# EAGLE design draft3_4lyr_reroute (EAGLE 6.1)
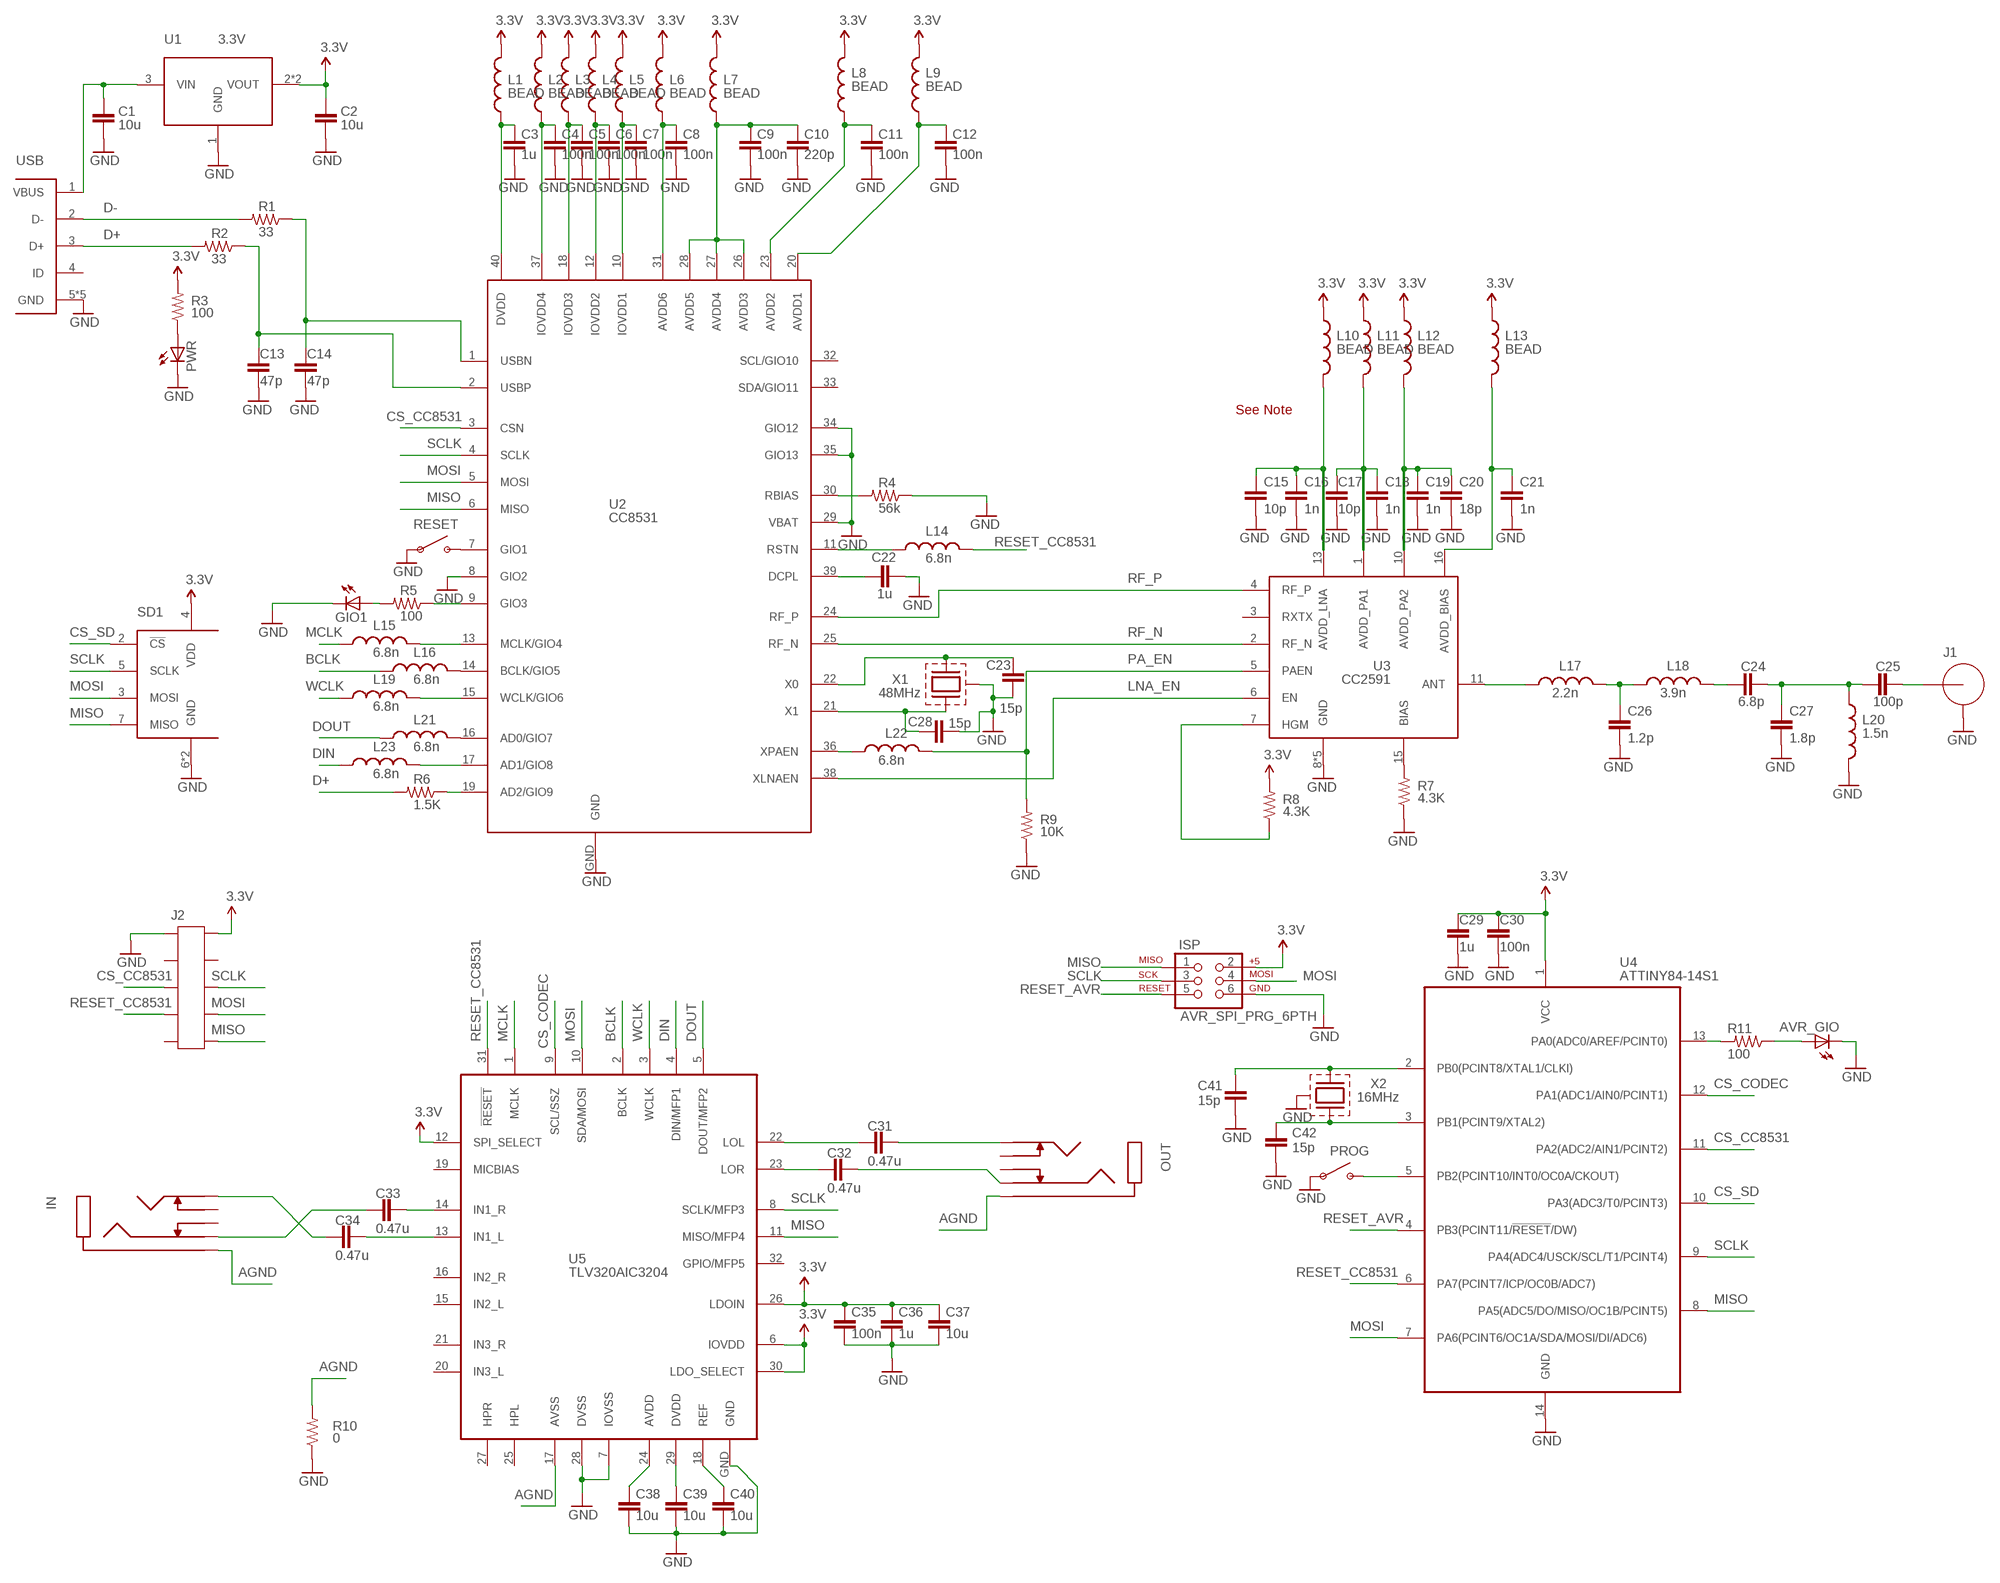
[diagram p0: schematic, sheet 1]

## Parts
AVR_GIO  LEDCHIP-LED0603  [CHIP-LED0603]
C1  10u  C-EUC0603  [C0603]
C2  10u  C-EUC0603  [C0603]
C3  1u  C-EUC0603  [C0603]
C4  100n  C-EUC0603  [C0603]
C5  100n  C-EUC0603  [C0603]
C6  100n  C-EUC0603  [C0603]
C7  100n  C-EUC0603  [C0603]
C8  100n  C-EUC0603  [C0603]
C9  100n  C-EUC0603  [C0603]
C10  220p  C-EUC0603  [C0603]
C11  100n  C-EUC0603  [C0603]
C12  100n  C-EUC0603  [C0603]
C13  47p  C-EUC0603  [C0603]
C14  47p  C-EUC0603  [C0603]
C15  10p  C-EUC0603  [C0603]
C16  1n  C-EUC0603  [C0603]
C17  10p  C-EUC0603  [C0603]
C18  1n  C-EUC0603  [C0603]
C19  1n  C-EUC0603  [C0603]
C20  18p  C-EUC0603  [C0603]
C21  1n  C-EUC0603  [C0603]
C22  1u  C-EUC0603  [C0603]
C23  15p  C-EUC0603  [C0603]
C24  6.8p  C-EUC0603  [C0603]
C25  100p  C-EUC0603  [C0603]
C26  1.2p  C-EUC0603  [C0603]
C27  1.8p  C-EUC0603  [C0603]
C28  15p  C-EUC0603  [C0603]
C29  1u  C-EUC0603  [C0603]
C30  100n  C-EUC0603  [C0603]
C31  0.47u  C-EUC0603  [C0603]
C32  0.47u  C-EUC0603  [C0603]
C33  0.47u  C-EUC0603  [C0603]
C34  0.47u  C-EUC0603  [C0603]
C35  100n  C-EUC0603  [C0603]
C36  1u  C-EUC0603  [C0603]
C37  10u  C-EUC0603  [C0603]
C38  10u  C-EUC0603  [C0603]
C39  10u  C-EUC0603  [C0603]
C40  10u  C-EUC0603  [C0603]
C41  15p  C-EUC0603  [C0603]
C42  15p  C-EUC0603  [C0603]
GIO1  LEDCHIP-LED0603  [CHIP-LED0603]
IN  PHONE_SW  [35RAPC4BV4]
ISP  AVR_SPI_PRG_6PTH  [2X3]
J1  SMA  [CONSMA003.031]
J2  HEADER-10P-SMD-MALE  [10P-0.05-HEADER]
L1  BEAD  INDUCTOR0603  [0603]
L2  BEAD  INDUCTOR0603  [0603]
L3  BEAD  INDUCTOR0603  [0603]
L4  BEAD  INDUCTOR0603  [0603]
L5  BEAD  INDUCTOR0603  [0603]
L6  BEAD  INDUCTOR0603  [0603]
L7  BEAD  INDUCTOR0603  [0603]
L8  BEAD  INDUCTOR0603  [0603]
L9  BEAD  INDUCTOR0603  [0603]
L10  BEAD  INDUCTOR0603  [0603]
L11  BEAD  INDUCTOR0603  [0603]
L12  BEAD  INDUCTOR0603  [0603]
L13  BEAD  INDUCTOR0603  [0603]
L14  6.8n  INDUCTOR0603  [0603]
L15  6.8n  INDUCTOR0603  [0603]
L16  6.8n  INDUCTOR0603  [0603]
L17  2.2n  INDUCTOR0603  [0603]
L18  3.9n  INDUCTOR0603  [0603]
L19  6.8n  INDUCTOR0603  [0603]
L20  1.5n  INDUCTOR0603  [0603]
L21  6.8n  INDUCTOR0603  [0603]
L22  6.8n  INDUCTOR0603  [0603]
L23  6.8n  INDUCTOR0603  [0603]
OUT  PHONE_SW  [35RAPC4BV4]
PROG  SPST-SMD  [TACT_SW]
PWR  LEDCHIP-LED0603  [CHIP-LED0603]
R1  33  R-US_R0603  [R0603]
R2  33  R-US_R0603  [R0603]
R3  100  R-US_R0603  [R0603]
R4  56k  R-US_R0603  [R0603]
R5  100  R-US_R0603  [R0603]
R6  1.5K  R-US_R0603  [R0603]
R7  4.3K  R-US_R0603  [R0603]
R8  4.3K  R-US_R0603  [R0603]
R9  10K  R-US_R0603  [R0603]
R10  0  R-US_R0603  [R0603]
R11  100  R-US_R0603  [R0603]
RESET  SPST-SMD  [TACT_SW]
SD1  MICROSDDM3AT  [DM3AT]
U1  3.3V  NX1117C  [SOT-223]
U2  CC8531  [S-PVQFN-N40]
U3  CC2591  [S-PVQFN-N16]
U4  ATTINY84-14S1  [SOIC14]
U5  TLV320AIC3204  [S-PVQFN-N32]
USB  USB_MICRO_AB  [USB_MICRO_AB]
X1  48MHz  XTAL-ABRACONABM3C  [ABM3C]
X2  16MHz  XTAL-ABRACONABMM  [ABMM]

## Nets
3.3V: C2.1 C29.1 C30.1 C35.1 C36.1 C37.1 ISP.2 J2.2 L1.2 L2.2 L3.2 L4.2 L5.2 L6.2 L7.2 L8.2 L9.2 L10.1 L11.1 L12.1 L13.1 R3.2 R8.2 SD1.4(VDD) U1.2(VOUT) U1.4(VOUT) U4.1(VCC) U5.6(IOVDD) U5.12(SPI_SELECT) U5.26(LDOIN) U5.30(LDO_SELECT)
AGND: IN.1(GND) OUT.1(GND) R10.2 U5.17(AVSS)
AVDD_BIAS: C21.1 L13.2 U3.16(AVDD_BIAS)
AVDD_LNA: C15.1 C16.1 L10.2 U3.13(AVDD_LNA)
AVDD_PA1: C17.1 C18.1 L11.2 U3.1(AVDD_PA1)
AVDD_PA2: C19.1 C20.1 L12.2 U3.10(AVDD_PA2)
BCLK: L16.1 U5.2(BCLK)
CS_CC8531: J2.5 U2.3(CSN) U4.11(PA2(ADC2/AIN1/PCINT2))
CS_CODEC: U4.12(PA1(ADC1/AIN0/PCINT1)) U5.9(SCL/SSZ)
CS_SD: SD1.2(!CS) U4.10(PA3(ADC3/T0/PCINT3))
D+: R2.2 R6.2 USB.3(D+)
D-: R1.2 USB.2(D-)
DIN: L23.1 U5.4(DIN/MFP1)
DOUT: L21.1 U5.5(DOUT/MFP2)
GND: AVR_GIO.C C1.2 C2.2 C3.2 C4.2 C5.2 C6.2 C7.2 C8.2 C9.2 C10.2 C11.2 C12.2 C13.2 C14.2 C15.2 C16.2 C17.2 C18.2 C19.2 C20.2 C21.2 C22.2 C23.2 C26.2 C27.2 C28.2 C29.2 C30.2 C35.2 C36.2 C37.2 C38.2 C39.2 C40.2 C41.1 C42.1 GIO1.C ISP.6 J1.GND1(GND) J1.GND2(GND) J1.GND3(GND) J1.GND4(GND) J2.1 L20.2 PROG.1 PROG.2 PWR.C R4.1 R7.1 R9.1 R10.1 RESET.1 RESET.2 SD1.6(GND) SD1.GND U1.1(GND) U2.8(GIO2) U2.29(VBAT) U2.34(GIO12) U2.35(GIO13) U2.GND U3.8(GND) U3.9(GND) U3.12(GND) U3.14(GND) U3.GND U4.14(GND) U5.7(IOVSS) U5.28(DVSS) U5.GND USB.5(GND) USB.GND1(GND) USB.GND2(GND) USB.GND3(GND) USB.GND4(GND) X1.2(CASE) X1.4(CASE) X2.2(CASE) X2.4(CASE)
IOVDD1: C14.1 R1.1 U2.1(USBN)
IOVDD2: C13.1 R2.1 U2.2(USBP)
LNA_EN: U2.38(XLNAEN) U3.6(EN)
MCLK: L15.1 U5.1(MCLK)
MISO: ISP.1 J2.10 SD1.7(MISO) U2.6(MISO) U4.8(PA5(ADC5/DO/MISO/OC1B/PCINT5)) U5.11(MISO/MFP4)
MOSI: ISP.4 J2.8 SD1.3(MOSI) U2.5(MOSI) U4.7(PA6(PCINT6/OC1A/SDA/MOSI/DI/ADC6)) U5.10(SDA/MOSI)
N$1: C28.1 U2.21(X1) X1.1
N$2: C23.1 U2.22(X0) X1.3
N$3: L14.1 U2.11(RSTN)
N$4: PROG.3 PROG.4 U4.5(PB2(PCINT10/INT0/OC0A/CKOUT))
N$5: L16.2 U2.14(BCLK/GIO5)
N$6: C1.1 U1.3(VIN) USB.1(VBUS)
N$7: R7.2 U3.15(BIAS)
N$8: R8.1 U3.7(HGM)
N$9: C25.2 J1.SIG
N$10: L21.2 U2.16(AD0/GIO7)
N$11: RESET.3 RESET.4 U2.7(GIO1)
N$12: C38.1 U5.24(AVDD)
N$13: L17.1 U3.11(ANT)
N$14: C26.1 L17.2 L18.1
N$15: C24.1 L18.2
N$16: C24.2 C25.1 C27.1 L20.1
N$17: C9.1 C10.1 L7.1 U2.26(AVDD3) U2.27(AVDD4) U2.28(AVDD5)
N$18: L22.1 U2.36(XPAEN)
N$19: R4.2 U2.30(RBIAS)
N$20: C40.1 U5.18(REF)
N$21: C22.1 U2.39(DCPL)
N$22: C11.1 L8.1 U2.23(AVDD2)
N$23: L15.2 U2.13(MCLK/GIO4)
N$24: R6.1 U2.19(AD2/GIO9)
N$25: L19.2 U2.15(WCLK/GIO6)
N$26: C12.1 L9.1 U2.20(AVDD1)
N$27: L23.2 U2.17(AD1/GIO8)
N$28: R5.1 U2.9(GIO3)
N$29: GIO1.A R5.2
N$30: C8.1 L6.1 U2.31(AVDD6)
N$31: PWR.A R3.1
N$32: C39.1 U5.29(DVDD)
N$33: C34.1 IN.2(L)
N$34: C33.2 U5.14(IN1_R)
N$35: C34.2 U5.13(IN1_L)
N$36: C33.1 IN.4(R)
N$37: C31.2 OUT.2(L)
N$38: C32.2 OUT.4(R)
N$39: C31.1 U5.22(LOL)
N$40: C32.1 U5.23(LOR)
N$41: C7.1 L5.1 U2.10(IOVDD1)
N$42: C6.1 L4.1 U2.12(IOVDD2)
N$43: C5.1 L3.1 U2.18(IOVDD3)
N$44: C4.1 L2.1 U2.37(IOVDD4)
N$45: C3.1 L1.1 U2.40(DVDD)
N$46: R11.2 U4.13(PA0(ADC0/AREF/PCINT0))
N$47: AVR_GIO.A R11.1
N$48: C41.2 U4.2(PB0(PCINT8/XTAL1/CLKI)) X2.1
N$49: C42.2 U4.3(PB1(PCINT9/XTAL2)) X2.3
PA_EN: L22.2 R9.2 U3.5(PAEN)
RESET_AVR: ISP.5 U4.4(PB3(PCINT11/!RESET!/DW))
RESET_CC8531: J2.7 L14.2 U4.6(PA7(PCINT7/ICP/OC0B/ADC7)) U5.31(!RESET)
RF_N: U2.25(RF_N) U3.2(RF_N)
RF_P: U2.24(RF_P) U3.4(RF_P)
SCLK: ISP.3 J2.6 SD1.5(SCLK) U2.4(SCLK) U4.9(PA4(ADC4/USCK/SCL/T1/PCINT4)) U5.8(SCLK/MFP3)
WCLK: L19.1 U5.3(WCLK)
Unconnected: IN.3(R_SW) IN.5(L_SW) J2.3 J2.4 J2.9 OUT.3(R_SW) OUT.5(L_SW) U2.32(SCL/GIO10) U2.33(SDA/GIO11) U3.3(RXTX) U5.15(IN2_L) U5.16(IN2_R) U5.19(MICBIAS) U5.20(IN3_L) U5.21(IN3_R) U5.25(HPL) U5.27(HPR) U5.32(GPIO/MFP5) USB.4(ID)

## Notes on the sheet
- See Note

## Library data of the parts
AVR_GIO GIO1 PWR = led:LED: LED OSRAM: - CHIPLED LG R971, LG N971, LY N971, LG Q971, LY Q971, LO R971, LY R971 LH N974, LH R974 LS Q976, LO Q976, LY Q976 LO Q996 - Hyper CHIPLED LW Q18S LB Q993, LB Q99A, LB R99A - SideLED LS A670, LO A670, LY A670, LG A670, LP A670 LB A673, LV A673, LT A673, LW A673 LH A674 LY A675 LS A676, LA A676, LO A676, LY A676, LW A676 LS A679, LY A679, LG A679 - Hyper Micro SIDELED® LS Y876, LA Y876, LO Y876, LY Y876 LT Y87S - SmartLED LW L88C, LW L88S LB L89C, LB L89S, LG L890 LS L89K, LO L89K, LY L89K LS L896, LA L896, LO L896, LY L896 - TOPLED LS T670, LO T670, LY T670, LG T670, LP T670 LSG T670, LSP T670, LSY T670, LOP T670, LYG T670 LG T671, LOG T671, LSG T671 LB T673, LV T673, LT T673, LW T673 LH T674 LS T676, LA T676, LO T676, LY T676, LB T676, LH T676, LSB T676, LW T676 LB T67C, LV T67C, LT T67C, LS T67K, LO T67K, LY T67K, LW E67C LS E67B, LA E67B, LO E67B, LY E67B, LB E67C, LV E67C, LT E67C LW T67C LS T679, LY T679, LG T679 LS T770, LO T770, LY T770, LG T770, LP T770 LB T773, LV T773, LT T773, LW T773 LH T774 LS E675, LA E675, LY E675, LS T675 LS T776, LA T776, LO T776, LY T776, LB T776 LHGB T686 LT T68C, LB T68C - Hyper Mini TOPLED® LB M676 - Mini TOPLED Santana® LG M470 LS M47K, LO M47K, LY M47K Source: http://www.osram.convergy.de LUXEON: - LUMILED® LXK2-PW12-R00, LXK2-PW12-S00, LXK2-PW14-U00, LXK2-PW14-V00 LXK2-PM12-R00, LXK2-PM12-S00, LXK2-PM14-U00 LXK2-PE12-Q00, LXK2-PE12-R00, LXK2-PE12-S00, LXK2-PE14-T00, LXK2-PE14-U00 LXK2-PB12-K00, LXK2-PB12-L00, LXK2-PB12-M00, LXK2-PB14-N00, LXK2-PB14-P00, LXK2-PB14-Q00 LXK2-PR12-L00, LXK2-PR12-M00, LXK2-PR14-Q00, LXK2-PR14-R00 LXK2-PD12-Q00, LXK2-PD12-R00, LXK2-PD12-S00 LXK2-PH12-R00, LXK2-PH12-S00 LXK2-PL12-P00, LXK2-PL12-Q00, LXK2-PL12-R00 Source: www.luxeon.com KINGBRIGHT: KA-3528ASYC Source: www.kingbright.com
C1-C42 = rcl:C-EU: CAPACITOR, European symbol
IN OUT = 00-EvaLibrary:PHONE_SW
ISP = SparkFun-Connectors:AVR_SPI_PRG_6: AVR ISP 6 Pin This is the reduced ISP connector for AVR programming. Common on Arduino. This footprint will take up less PCB space and can be used with a 10-pin to 6-pin adapter such as SKU: BOB-08508
J1 = 00-EvaLibrary:SMA
J2 = 00-EvaLibrary:HEADER-10P
L1-L23 = SparkFun:INDUCTOR: Inductors Basic Inductor/Choke - 0603 and 1206. Footprints are not proven and vary greatly between part numbers.
PROG RESET = 00-EvaLibrary:SPST
R1-R11 = rcl:R-US_: RESISTOR, American symbol
SD1 = 00-EvaLibrary:MICROSD
U1 = 00-EvaLibrary:NX1117C
U2 = 00-EvaLibrary:CC8531
U3 = 00-EvaLibrary:CC2591
U4 = 00-EvaLibrary:ATTINY84
U5 = 00-EvaLibrary:TLV320AIC3204
USB = 00-EvaLibrary:USB_MICRO_AB
X1 X2 = 00-EvaLibrary:XTAL-ABRACON

## Board
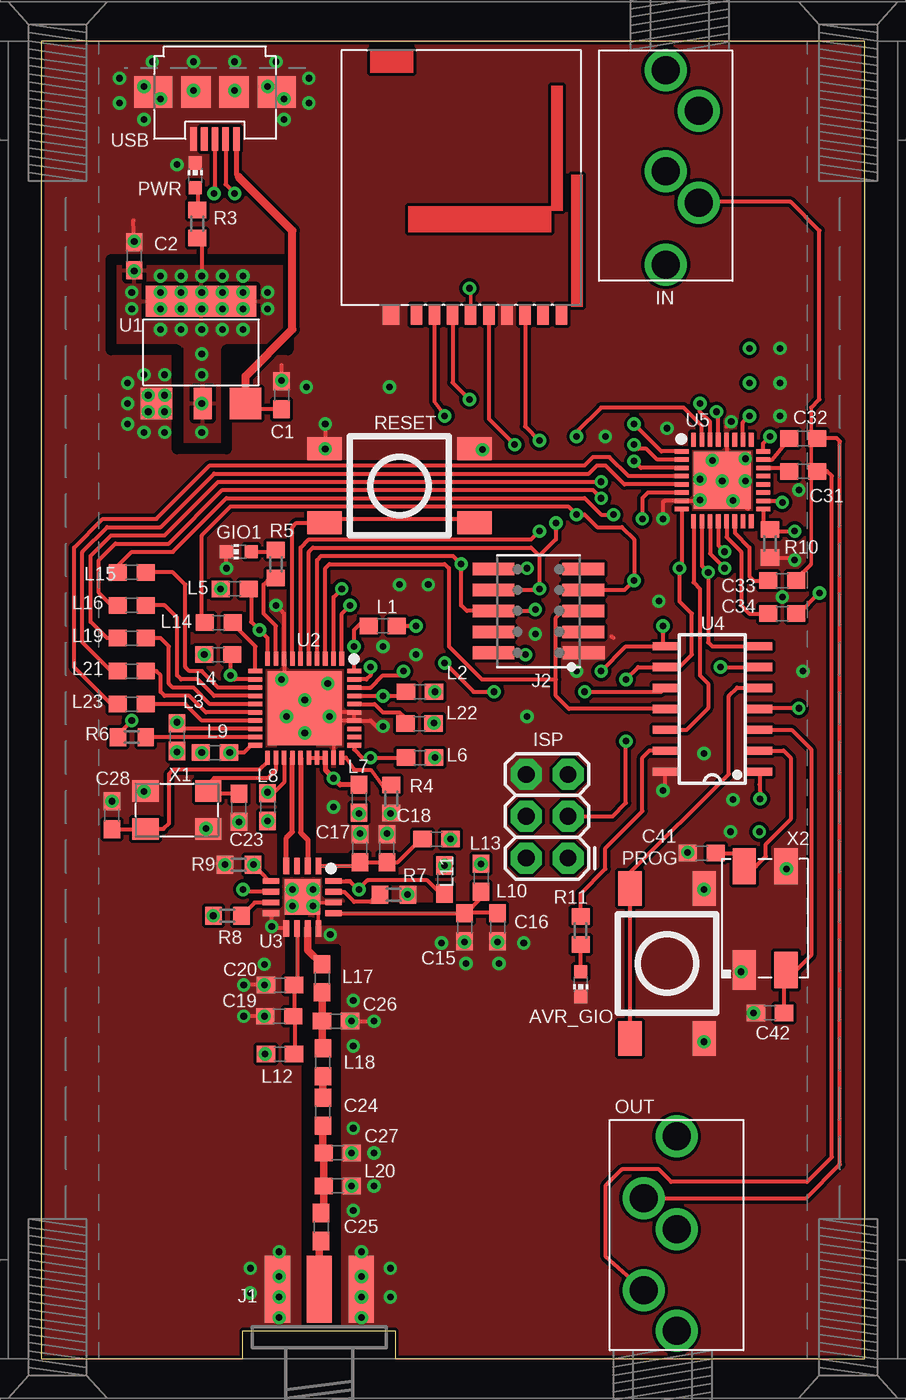
[diagram p1: board, top side]
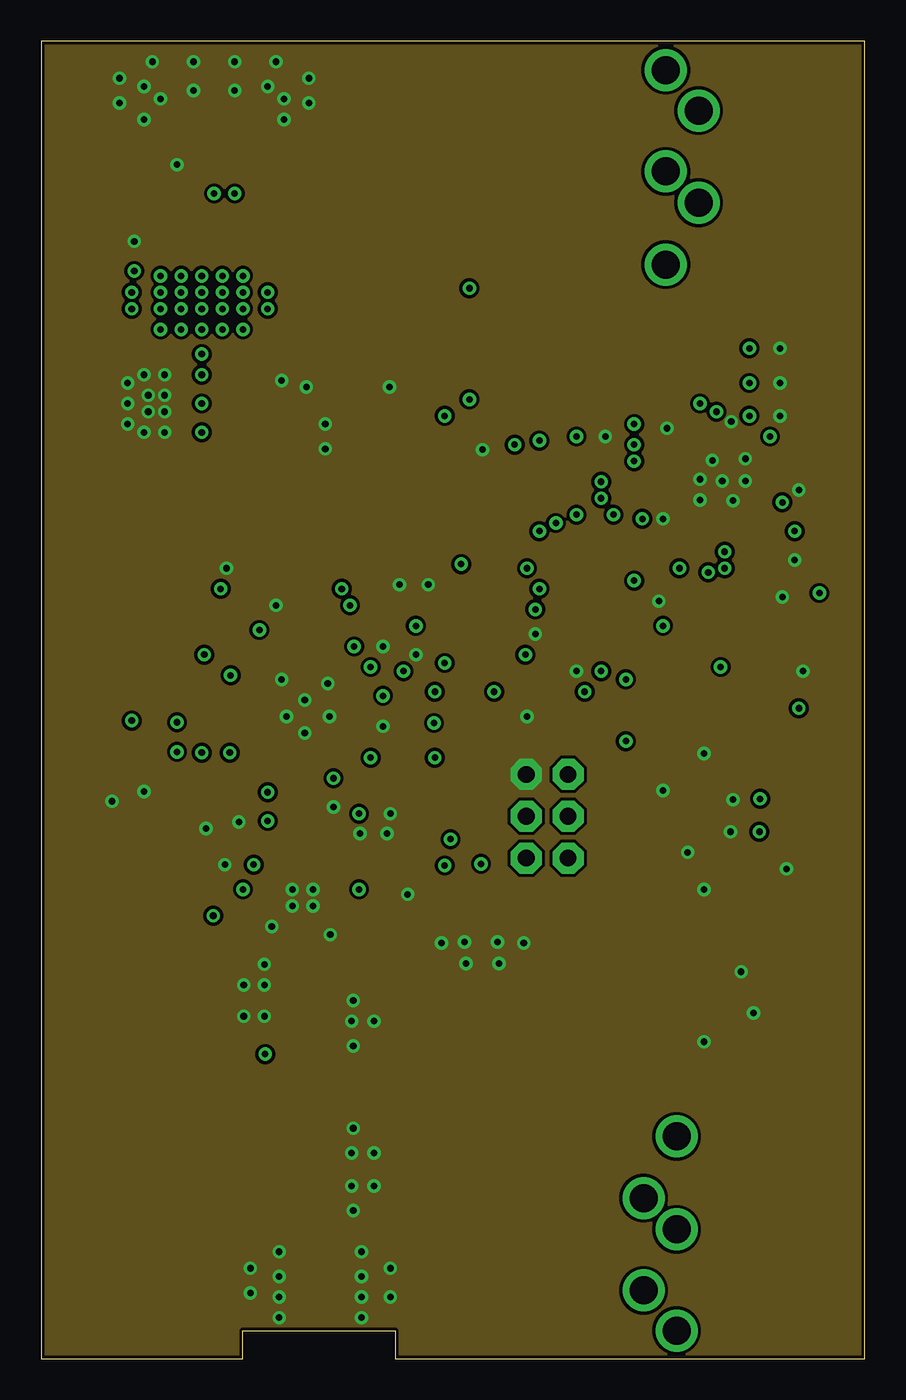
[diagram p2: board, inner layer Route2]
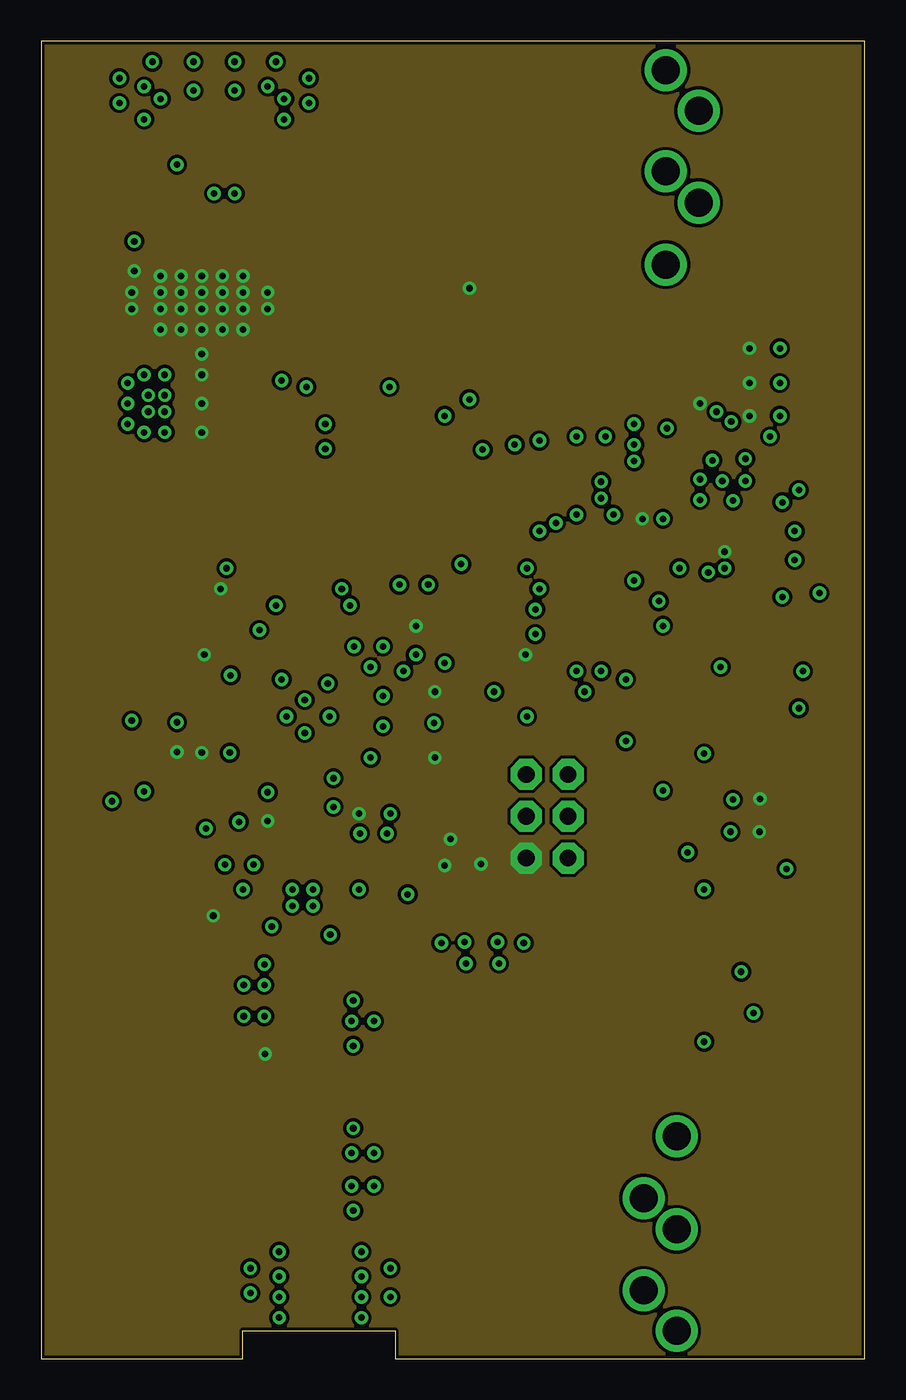
[diagram p3: board, inner layer Route3]
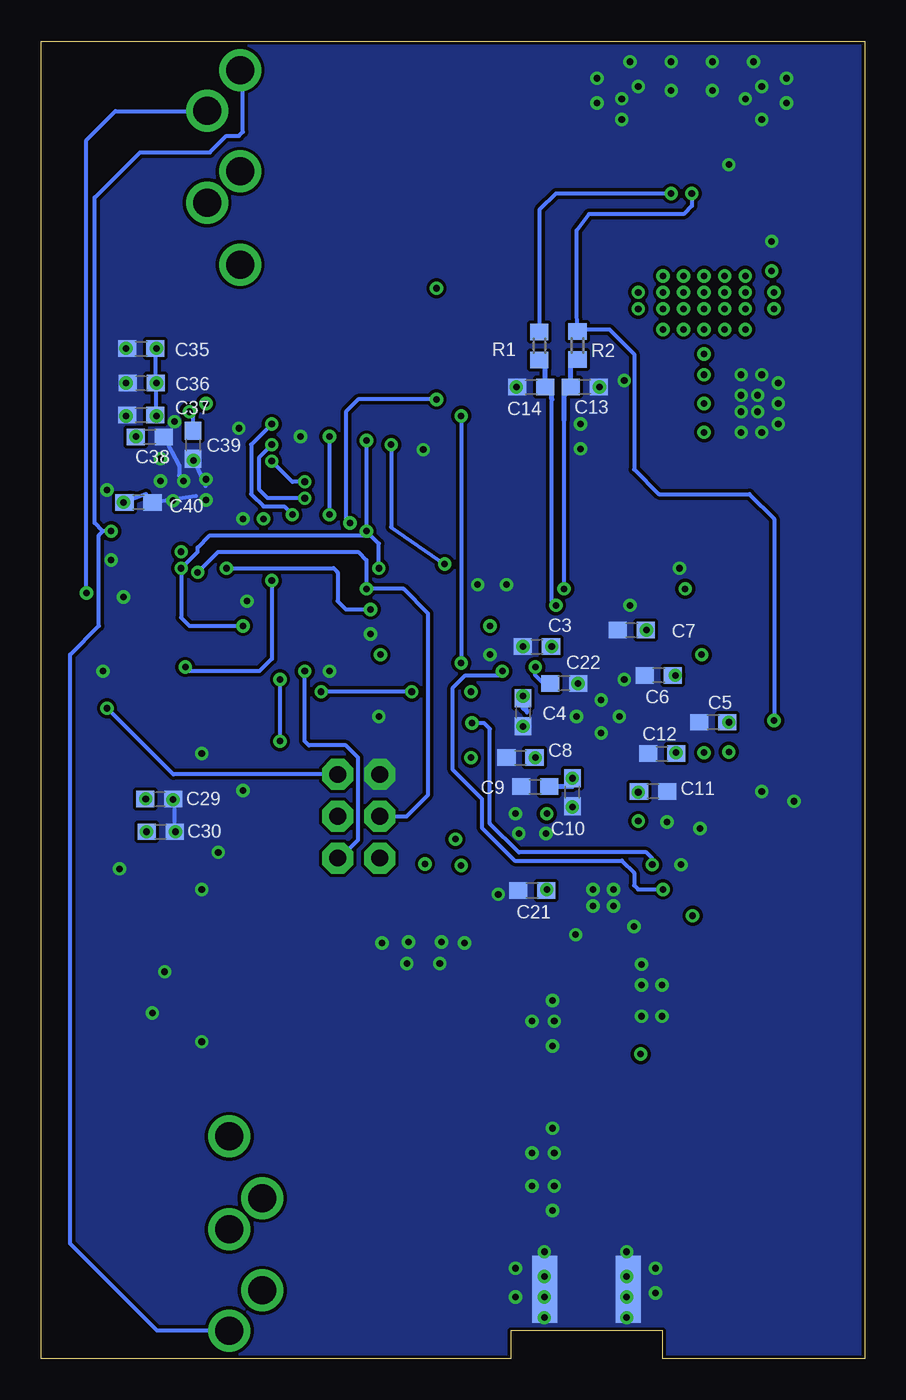
[diagram p4: board, bottom side, seen from below]

Size 50 x 80 mm. Coordinates in mm from the lower left corner, seen from the top.
Outline: 0,0 12.25,0 12.25,1.7 21.5,1.7 21.5,0 50,0 50,80 0,80 0,0
Copper layers (1+2*3+16): Top 0.034290625mm / dielectric 0.24891875mm / Route2 0.034290625mm / dielectric 39mil / Route3 0.034290625mm / dielectric 0.24891875mm / Bottom 0.034290625mm
Design rules: minimum track width 6mil, minimum drill 15mil, track to track 6mil, track to pad 6mil, pad to pad 6mil, via to via 6mil, smd to smd 0mil, copper to edge 6mil, drill to drill 6mil, minimum pad ring 10mil, minimum via ring 8mil, stop-mask expansion 4mil, vias tented up to drill 0mil, thermal gap 10mil
tRestrict: area 16,1 to 18,25; area 14.5,29.5 to 16.5,37.5; area 16.8,26.5 to 25.3,27.5; area 15,23.3 to 16,27.1; area 16.8,29.5 to 19.2,30.5; 8 lines

### Footprints (pad centres in the part's own frame; a part is rotated, then mirrored left to right if it is on the bottom)
CHIP-LED0603 = smd 0.8 x 0.8: A 0,-0.75; C 0,0.75
C0603 = smd 1.1 x 1: 1 -0.85,0; 2 0.85,0
35RAPC4BV4 = drill 1.7 pad 2.4: 1 1.2,-0.85; 2 3.65,1.15; 3 7.35,-0.85; 4 9.25,1.15; 5 13,-0.85
2X3 = drill 1.016 pad 1.88 octagon: 1 0,0; 2 0,2.54; 3 2.54,0; 4 2.54,2.54; 5 5.08,0; 6 5.08,2.54
CONSMA003.031 = smd 4.064 x 1.524: GND1 0,2.54; GND2 0,-2.54; SIG 0,0 | smd 4.064 x 1.524 bottom: GND3 0,2.54; GND4 0,-2.54
10P-0.05-HEADER = smd 2.54 x 0.762: 1 -2.751,2.54; 2 2.731,2.54; 3 -2.731,1.27; 4 2.731,1.27; 5 -2.731,0; 6 2.731,0; 7 -2.731,-1.27; 8 2.731,-1.27; 9 -2.731,-2.54; 10 2.731,-2.54
0603 = smd 1.1 x 1: 1 -0.85,0; 2 0.85,0
TACT_SW = smd 1.4 x 2.1: 1 2.25,4.55; 2 2.25,-4.55; 3 -2.25,4.55; 4 -2.25,-4.55
R0603 = smd 1 x 1.1: 1 -0.85,0; 2 0.85,0
DM3AT = smd 0.7 x 1.2: 1 0,0.6; 2 -1.1,0.6; 3 -2.2,0.6; 4 -3.3,0.6; 5 -4.4,0.6; 6 -5.5,0.6; 7 -6.6,0.6; 8 -7.7,0.6; SW -8.8,0.6 | smd 1 x 1.2: GND 1.55,0.6
SOT-223 = smd 1.9 x 1.9: 1 -2.7,-3.1; 3 2.7,-3.1 | smd 1.1 x 1.9: 2 0.1,-3.1 | smd 6.7 x 1.9: 4 0,3.1
S-PVQFN-N40 = smd 0.85 x 0.28: 1 -3,2.25; 2 -3,1.75; 3 -3,1.25; 4 -3,0.75; 5 -3,0.25; 6 -3,-0.25; 7 -3,-0.75; 8 -3,-1.25; 9 -3,-1.75; 10 -3,-2.25; 21 3,-2.25; 22 3,-1.75; 23 3,-1.25; 24 3,-0.75; 25 3,-0.25; 26 3,0.25; 27 3,0.75; 28 3,1.25; 29 3,1.75; 30 3,2.25 | smd 0.28 x 0.85: 11 -2.25,-3; 12 -1.75,-3; 13 -1.25,-3; 14 -0.75,-3; 15 -0.25,-3; 16 0.25,-3; 17 0.75,-3; 18 1.25,-3; 19 1.75,-3; 20 2.25,-3; 31 2.25,3; 32 1.75,3; 33 1.25,3; 34 0.75,3; 35 0.25,3; 36 -0.25,3; 37 -0.75,3; 38 -1.25,3; 39 -1.75,3; 40 -2.25,3 | smd 4.5 x 4.5: GND 0,0
S-PVQFN-N16 = smd 1 x 0.35: 1 -1.9,0.975; 2 -1.9,0.325; 3 -1.9,-0.325; 4 -1.9,-0.975; 9 1.9,-0.975; 10 1.9,-0.325; 11 1.9,0.325; 12 1.9,0.975 | smd 0.35 x 1: 5 -0.975,-1.9; 6 -0.325,-1.9; 7 0.325,-1.9; 8 0.975,-1.9; 13 0.975,1.9; 14 0.325,1.9; 15 -0.325,1.9; 16 -0.975,1.9 | smd 2.16 x 2.16: GND 0,0
SOIC14 = smd 0.5 x 1.5: 1 3.81,2.875; 2 2.54,2.875; 3 1.27,2.875; 4 0,2.875; 5 -1.27,2.875; 6 -2.54,2.875; 7 -3.81,2.875; 8 -3.81,-2.875; 9 -2.54,-2.875; 10 -1.27,-2.875; 11 0,-2.875; 12 1.27,-2.875; 13 2.54,-2.875; 14 3.81,-2.875
S-PVQFN-N32 = smd 0.85 x 0.28: 1 -2.475,1.75; 2 -2.475,1.25; 3 -2.475,0.75; 4 -2.475,0.25; 5 -2.475,-0.25; 6 -2.475,-0.75; 7 -2.475,-1.25; 8 -2.475,-1.75; 17 2.475,-1.75; 18 2.475,-1.25; 19 2.475,-0.75; 20 2.475,-0.25; 21 2.475,0.25; 22 2.475,0.75; 23 2.475,1.25; 24 2.475,1.75 | smd 0.28 x 0.85: 9 -1.75,-2.475; 10 -1.25,-2.475; 11 -0.75,-2.475; 12 -0.25,-2.475; 13 0.25,-2.475; 14 0.75,-2.475; 15 1.25,-2.475; 16 1.75,-2.475; 25 1.75,2.475; 26 1.25,2.475; 27 0.75,2.475; 28 0.25,2.475; 29 -0.25,2.475; 30 -0.75,2.475; 31 -1.25,2.475; 32 -1.75,2.475 | smd 3.45 x 3.45: GND 0,0
USB_MICRO_AB = smd 0.4 x 1.4: 1 -1.3,2.85; 2 -0.65,2.85; 3 0,2.85; 4 0.65,2.85; 5 1.3,2.85 | smd 2.3 x 1.9: GND1 -3.75,0; GND4 3.75,0 | smd 1.8 x 1.9: GND2 -1.15,0; GND3 1.15,0
ABM3C = smd 1.6 x 1.3: 1 -1.9,-1.15; 2 1.9,-1.15; 3 1.9,1.15; 4 -1.9,1.15
ABMM = smd 2.2 x 1.4: 1 -3.15,-1.27; 2 -3.15,1.27; 3 3.15,1.27 | smd 2.4 x 1.4: 4 3.15,-1.27

### Placement (x,y rotation side)
AVR_GIO  32.75,22.75 180 top
C1  14.6,58.51 90 top
C2  5.65,66.95 90 top
C3  19.9,43.25 180 bottom
C4  20.75,39.25 270 bottom
C5  9.2,38.65 180 bottom
C6  12.5,41.5 180 bottom
C7  14.15,44.25 180 bottom
C8  20.9,36.5 180 bottom
C9  20,34.75 180 bottom
C10  17.75,34.4 270 bottom
C11  12.85,34.45 0 bottom
C12  12.3,36.75 180 bottom
C13  17,59 0 bottom
C14  20.25,59 180 bottom
C15  25.7,26.2 270 top
C16  27.7,26.2 270 top
C17  19.35,31 90 top
C18  21,31 90 top
C19  14.45,20.8 180 top
C20  14.5,22.7 180 top
C21  20.19,28.44 180 bottom
C22  18.25,41 0 bottom
C23  12,33.45 270 top
C24  17.1,15 270 top
C25  17,8 270 top
C26  17.9,20.5 0 top
C27  18,12.5 0 top
C28  4.3,33 90 top
C29  42.82,33.98 0 bottom
C30  42.75,32 0 bottom
C31  46.28,53.87 0 top
C32  46.28,55.87 0 top
C33  45,47.25 180 top
C34  45,45.25 180 top
C35  43.93,61.33 180 bottom
C36  43.9,59.25 180 bottom
C37  43.92,57.3 180 bottom
C38  43.41,55.98 0 bottom
C39  40.77,55.49 270 bottom
C40  44.09,52 0 bottom
C41  40.1,30.7 0 top
C42  44.25,21 0 top
GIO1  12,49 90 top
IN  38.77,79.44 270 top
ISP  31.99,30.4 90 top
J1  16.89,4.22 90 top
J2  30.19,45.41 180 top
L1  20.75,44.5 0 top
L2  23,40.5 0 top
L3  8.25,37.75 270 top
L4  10.75,42.75 180 top
L5  11.75,46.75 180 top
L6  23,36.5 0 top
L7  19.3,34 270 top
L8  13.75,33.5 270 top
L9  10.55,36.8 180 top
L10  26.7,29.2 270 top
L11  24,31.55 180 top
L12  14.5,18.5 0 top
L13  24.5,29.1 270 top
L14  10.77,44.71 180 top
L15  5.5,47.75 0 top
L16  5.5,45.75 0 top
L17  17.05,23.1 270 top
L18  17.1,18 270 top
L19  5.5,43.75 0 top
L20  18,10.5 0 top
L21  5.5,41.75 0 top
L22  22.97,38.56 0 top
L23  5.5,39.75 0 top
OUT  37.73,0.51 90 top
PROG  38,24 0 top
PWR  9.35,71.85 0 top
R1  19.75,61.5 90 bottom
R2  17.44,61.52 90 bottom
R3  9.48,68.91 270 top
R4  21.25,34 90 top
R5  14.25,48.25 90 top
R6  5.5,37.75 180 top
R7  21.41,28.18 180 top
R8  11.3,26.9 180 top
R9  12,30 0 top
R10  44.25,49.5 90 top
R11  32.75,26 90 top
RESET  21.75,53 90 top
SD1  22.78,63.99 180 top
U1  9.71,61.11 0 top
U2  16,39.5 270 top
U3  15.86,28.03 270 top
U4  40.75,39.46 270 top
U5  41.36,53.34 0 top
U$1  [HAMMOND_1455C802]  25,40 90 top
USB  10.55,76.91 180 top
X1  8.24,33.32 0 top
X2  43.95,26.75 270 top

### Tracks (layer width: path | path; a pad name or v marks a point on that pad's centre or on a via)
3.3V  (via drill 0.4)
  Top 0.2: 12.25,64.25 9.75,64.25 | SD1.4 26.08,64.92 v26,65
  Top 0.254: 9.7,36.75 L9.2 v9.75,36.8 9.8,36.85 | L7.2 v19.3,33.1 | 10.3,26.8 10.5,27 10.5,26.95 R8.2 | U5.26 42.61,56.86 v43,57.25 | U5.6 36.84,52.59 36.5,52.25 v36.5,51 | U5.12 41.11,49.39 v41.5,49 | 9.81,57.44 U1.2 9.81,58.19 9.75,58.25 | L8.2 13.75,32.5 | U5.30 40.61,56.89 40,57.5 v40,58 | 9.5,66 v9.75,65.75 9.75,68.06 R3.2 | L3.2 v8.25,36.85 | L1.2 v22.75,44.5 | v29.4,42.75 28.4,42.85 27.5,43 27.46,42.96 J2.2 | U4.1 43.62,34.88 v43.65,34
  Top 0.3: 13.5,18.5 v13.6,18.5 L12.1 | L6.2 v23.9,36.5 | 24.25,40.5 L2.2 23.9,40.55 v23.9,40.5
  Bottom 0.254: C35.1 43.08,59.28 C36.1 43.05,57.32 C37.1 42.67,57.58 | 43.67,32.07 C30.1 | C29.1 43.73,33.98 v43.65,34
  Bottom 0.365: 43.05,57.32 43.05,57.3 v43,57.25
  other vias: 9.9,42.75 24.85,31.55 24.5,29.95 10.45,26.9 13.75,32.65 43.6,32 5.5,64.75 7.25,62.5 13.75,64.75 9.75,56.25 5.5,63.75 8.5,62.5 9.75,62.5 11,62.5 12.25,62.5 13.75,63.75 7.25,65.75 8.5,65.75 11,65.75 12.25,65.75 9.75,59.75 9.75,61 26.7,30.05 10.9,46.75 43,59.25 43,61.35 5.65,66.05 12.25,63.75 11,63.75 9.75,63.75 8.5,63.75 7.25,63.75 7.25,64.75 8.5,64.75 9.75,64.75 11,64.75 12.25,64.75 9.75,58
  pour Route3 (isolate 0.2, no thermals): 0,0 50,0 50,80 0,80
  pour Top (isolate 0.2): 4.5,66.5 14.75,66.5 14.75,61.5 11,61.5 11,55.5 8.75,55.5 8.75,61.5 4.5,61.5
AGND  (via drill 0.4)
  Top 0.254: R10.2 43.84,50.77 U5.17 43.84,50.66 44.25,50.25 v45.75,50.25
  Bottom 0.254: v45.75,50.25 46.25,50.25 | 46.25,50.25 46.75,50.75 46.75,70.5 44,73.25 39.75,73.25 38.75,74.25 38,74.25 37.75,74.5 37.75,78.07 IN.1 | OUT.1 42.96,1.71 48.25,7 48.25,42.75 46.5,44.5 46.5,50 46.25,50.25
AVDD_BIAS  (via drill 0.4)
  Top 0.254: L13.2 24.2,28.3 23.45,29.05 19.8,29.05 19.25,28.5 | U3.16 18.5,29 | 18.5,29 18.75,29 | v19.3,28.5 19.25,28.5 | 19.25,28.5 18.75,29 18.5,29
  Bottom 0.254: C21.1 19.31,28.44 19.25,28.5 v19.3,28.5
AVDD_LNA
  Top 0.254: U3.13 25.55,27.05 25.6,27 | 25.6,27 25.7,26.9 | 27.6,27.1 25.75,27.1 C15.1 | 27.6,27.1 27.7,27.1 | C15.1 25.65,27.05 25.6,27 | C16.1 27.65,27.05 27.6,27.1 | L10.2 26.7,27.95 25.75,27 C15.1
AVDD_PA1
  Top 0.254: U3.1 19.23,29.93 19.25,30.25 C17.1 C18.1 21.65,30.15 23.1,31.6 L11.2
AVDD_PA2
  Top 0.254: U3.10 15.54,22.64 15.4,22.5 C20.1 15.35,20.65 | 15.35,20.65 15.4,20.6 15.4,18.6 L12.2 | 15.35,20.65 C19.1
BCLK  (via drill 0.4)
  Top 0.254: L16.1 4.25,45.75 3.5,46.5 3.5,48.5 4.5,49.5 7.75,49.5 11,52.75 33.5,52.75 v34,52.25 | U5.2 37.41,54.59 36.75,55.25 36.25,55.25 v36,55.5
  Bottom 0.254: v34,52.25 36.25,52.25 36.75,52.75 36.75,54.75 v36,55.5
CS_CC8531
  Top 0.254: U2.3 17.25,48 17.5,48.25 24.5,48.25 24.75,48 24.75,43.25 26.75,41.25 31.25,41.25 | U4.11 32.04,39.46 31.25,40.25 31.25,41.25 | 31.25,41.25 31.25,45 31.66,45.41 J2.5
CS_CODEC
  Top 0.254: U4.12 39.19,38.19 40.5,39.5 40.5,41 40,41.5 40,46.75 39.61,47.14 U5.9
CS_SD  (via drill 0.4)
  Top 0.2: 37.65,40.5 U4.10
  Top 0.254: SD1.2 23.88,58.12 v24.5,57.25 | v24.5,42.25 26.25,40.5 v27.5,40.5 | v33,40.5 37.65,40.5
  Bottom 0.2: 24.5,42.5 v24.5,42.25
  Bottom 0.254: v24.5,57.25 24.5,42.5 | v27.5,40.5 v33,40.5
D+  (via drill 0.4)
  Top 0.254: R6.2 4.65,37.9 v5.5,38.75 | USB.3 10.55,71.05 v10.5,70.75
  Bottom 0.254: 17.44,62.31 17.25,62.5 15.5,62.5 14,61 14,54 12.5,52.5 7,52.5 5.5,51 v5.5,38.75 | v10.5,70.75 10.5,70 11,69.5 16.75,69.5 17.5,68.5 17.5,63.43 R2.2 17.44,62.31 | 17.44,62.31 17.5,62.25
D-  (via drill 0.4)
  Top 0.254: USB.2 11.2,71.3 v11.75,70.75
  Bottom 0.254: v11.75,70.75 18.75,70.75 19.75,69.75 R1.2
DIN
  Top 0.254: L23.1 4.25,39.75 2,42 2,49.25 3.75,51 7,51 10.25,54.25 33,54.25 33.5,54.75 34.5,54.75 35.66,53.59 U5.4
DOUT
  Top 0.254: L21.1 4.25,41.75 2.5,43.5 2.5,49 4,50.5 7.25,50.5 10.5,53.75 33.25,53.75 33.75,54.25 34.25,54.25 35.41,53.09 U5.5
GND  (via drill 0.4)
  Top 0.2: U3.14 16.3,27.7 16,28 15.89,28 U3.GND 16.84,27.05 U3.12 | U2.29 17.75,37.75 16.25,39.25
  Top 0.254: v14.25,45.75 14.75,45.25 U2.8 14.75,40.75 U2.GND 16.25,39.25 | 24.4,25.35 v24.3,25.25 | 27.85,24.05 v27.8,24 | 25.75,24.05 v25.8,24 | 29.2,25.35 v29.3,25.25 | U3.8 13.96,26.29 v14,26.25 14.12,26.13 U3.9 | X1.4 6.73,34.47 v6.25,34.45 | C23.2 12,32.7 | 10.5,31.81 X1.2 | 16.75,38.75 16.25,39.25 | U2.34 U2.35 16.25,39.25 | U2.34 20,38.75 20.5,38.25 | U2.34 17,38.75 16.25,39.5 | C26.2 v20.2,20.5 | C20.2 v12.3,22.7 | C19.2 v12.3,20.8 | 10.7,30.07 R9.1 | v11.25,48 GIO1.C | 41.61,53.61 41.25,53.25 42.91,51.59 | 40.11,52.09 U5.7 37.84,52.09 37.75,52 v37.75,51 | 34.63,43.87 34.75,43.75 | U5.28 41.61,53.61 | 41.61,53.61 41.61,53.59 U5.GND | 41.61,56.61 41.75,56.75 | U4.14 37.88,34.62 v37.75,34.5 | C2.2 5.6,69.1 | C1.2 14.6,60.35 | v14.6,59.4 14.5,59.5 | RESET.1 v17.25,55.25 v17.25,56.75 | R10.1 45.65,48.65 v45.75,48.5
  Top 0.3: 7.25,58.25 v7.5,58.5 7.25,58.75 7.25,58.5 7,58.25 | 7.25,58.25 U1.1 | 7,58.25 6.25,58.25 | 7,58.5 7.25,58.25 | 7.25,58.25 7,58.25 | 7,58.25 6.75,58
  Bottom 0.254: C37.2 45,57.3 v44.85,57.25 | C36.2 v44.85,59.25 | C35.2 44.97,61.33 v44.85,61.35 | C30.2 41.9,33.91 C29.2 | C39.2 40.02,52.98 | C40.2 40.6,52.4 | C38.2 41.63,54.23 | 41.63,54.23 41.61,54.25 | 41.63,54.23 41.63,53.63 | C13.2 v16.1,59 | C14.2 v21.15,59
  other vias: 22.25,28.2 21,31.9 17.55,25.75 4.3,33.85 12,32.6 10,32.2 11.15,30 41.9,56.9 40.75,54.55 5.65,67.85 5.25,58 6.25,59.75 5.25,56.75 7.5,59.75 5.25,59.25 6.25,56.25 8.25,72.5 4.75,77.75 4.75,76.25 6.25,75.25 16.25,77.75 16.25,76.25 14.75,75.25 16,40 16,38 38,56.5 34.25,56 18.85,20.5 18.95,19 18.95,14 20.2,12.5 20.2,10.5 18.95,9 22.75,42.75 21.75,47 23.5,47 29.5,39 30,44 13.55,23.95 37.5,46 46,52.75 45,46.25 21.2,3.75 21.2,5.5 19.45,6.5 14.45,6.5 12.7,5.5 12.7,4 6.75,78.75 9.25,78.75 11.75,78.75 14.25,78.75 7.5,56.25 18.95,21.75 13.55,22.7 13.55,20.8 18.85,12.5 18.85,10.5 25.7,25.3 27.7,25.3 21.2,33.1 17.75,33.5 20.75,43.25 14.9,39 20.75,38.4 17.4,41 14.6,41.25 41.85,32 42,33.95 40,53.4 42,52.1 6.5,58.5 7.5,57.5 6.5,57.5 6.25,77.25 7.25,76.5 13.75,77.25 14.75,76.5 11.75,77 9.25,77 26.8,55.2 19.35,31.9 15.25,27.5 16.5,27.5 40,52.15 42.75,54.65 42.75,53.3 41.35,53.3 19.45,5 19.45,3.75 19.45,2.5 14.45,5 14.45,3.75 14.45,2.5 40.25,36.75 40.25,28.5 40.25,19.25 42.5,23.5 45.25,29.75 39.25,30.75 43.25,21 15.25,28.5 16.5,28.5 17.5,39 46.25,41.75 32.5,41.75
  pour Route2 (isolate 0.2, no thermals): 0,0 50,0 50,80 0,80
  pour Top (isolate 0.2, no thermals): 0,80 50,80 50,0 0,0
  pour Bottom (isolate 0.2, no thermals): 0,80 50,80 50,0 0,0
IOVDD1  (via drill 0.4)
  Top 0.254: U2.1 18.25,45.25 v18.75,45.75
  Bottom 0.254: v18.75,45.75 19,46 19,58.25
  Bottom 0.3: 19,58.25 19,58.6 C14.1 19.4,60.3 R1.1
IOVDD2  (via drill 0.4)
  Top 0.254: U2.2 17.75,46.25 v18.25,46.75
  Bottom 0.254: v18.25,46.75 18.25,57 | C13.1 17.85,58.9 17.88,58.88
  Bottom 0.3: 18.25,57 18.25,58.5 17.88,58.88 17.75,59 | C13.1 17.85,60.26 R2.1
LNA_EN  (via drill 0.4)
  Top 0.254: U3.6 12.39,28.36 v12.25,28.5 | U2.38 20,40.75 20.75,41.5 21.75,41.5 v22,41.75
  Bottom 0.254: v22,41.75 22.25,41.5 24.25,41.5 25,40.75 25,35.75 23.25,34 23.25,32.25 21.25,30.25 14.75,30.25 14,29.5 14,28.75 13.75,28.5 v12.25,28.5
MCLK  (via drill 0.4)
  Top 0.254: L15.1 4.65,48.15 5.5,49 8,49 11.25,52.25 33,52.25 34,51.25 v34.75,51.25 | U5.1 37.66,55.09 v36,56.75
  Bottom 0.254: v36,56.75 37.25,55.5 37.25,52.5 36.5,51.75 35.25,51.75 v34.75,51.25
MISO  (via drill 0.4)
  Top 0.254: U2.6 15.75,49.25 16.25,49.75 29.75,49.75 v30.25,50.25 | U5.11 40.61,48.89 v41.5,48 | v37.75,44.5 37.75,43.4 U4.8 37.85,43.25 35.5,43.25 v34,41.75 | SD1.7 29.38,56.62 v30.25,55.75 | J2.10 29.45,47.95 v29.5,48
  Bottom 0.254: v30.25,50.25 30.5,50 39.75,50 40.5,49.25 40.5,49 v41.5,48 41.5,45 41,44.5 v37.75,44.5 | ISP.1 31.85,30.4 30.75,31.5 30.75,36.5 31.5,37.25 33.75,37.25 34,37.5 v34,41.75 | v30.25,55.75 v30.25,50.25 | v29.5,48 29.5,49.5 v30.25,50.25
MOSI  (via drill 0.4)
  Top 0.254: U2.5 16.25,49 16.5,49.25 29.75,49.25 30.25,48.75 | U5.10 40.11,48.14 v40.5,47.75 40.5,43.5 40.75,43.25 43.6,43.25 U4.7 | SD1.3 24.98,59.27 v26,58.25 | J2.8 30.18,46.68 v30.25,46.75 30.25,48.75 | v31.25,50.75 31.25,49.75 30.25,48.75
  Bottom 0.254: v40.5,47.75 39.25,49 30.75,49 30.25,48.5 v30.25,46.75 28,46.75 26.5,45.25 26.5,34.25 27.81,32.94 ISP.4 | v26,58.25 30.75,58.25 31.5,57.5 31.5,51 v31.25,50.75
N$1
  Top 0.254: X1.1 5.78,32.17 | U2.21 13.75,36.25 13.25,35.75 8,35.75 7.75,35.5 7.75,32.5 7.42,32.17 X1.1 | 6.15,31.98 X1.1 | C28.1 6.15,32.15 6.25,32.25 6.26,32.25 X1.1
N$2
  Top 0.254: X1.3 10.14,34.34 | U2.22 14.25,35.75 13.75,35.25 10.5,35.25 10.14,34.89 X1.3 | 10.06,34.05 X1.3 | C23.1 10.31,34.3 X1.3
N$3
  Top 0.254: U2.11 13,43.25 11.54,44.71 L14.1
N$4
  Top 0.254: U4.5 43.6,40.75 42.25,40.75 41.75,40.25 41.75,35.5 35.75,29.5 PROG.3 35.75,20.5 35.75,19.5 PROG.4
N$5
  Top 0.254: U2.14 10.5,40.25 9.5,41.25 8.5,41.25 8.25,41.5 8.25,45 7.5,45.75 L16.2
N$6
  Top 0.254: C1.1 12.84,57.66 12.5,58 | 12.25,58.25 12.5,58 | 12.5,58 U1.3
  Top 0.3: USB.1 11.85,71.9 12,71.75
  Top 0.5: U1.3 12.41,59.66 15.25,62.5 15.25,68.5 12,71.75
N$7
  Top 0.254: 20.2,28.3 20.3,28.4 | R7.2 20.31,28.19 20.2,28.3 | 20.2,28.3 20.2,27.95 20,27.75 19,27.75 18.39,28.36 U3.15
N$8
  Top 0.254: U3.7 12.96,27.7 R8.1
N$9
  Top 0.46: J1.SIG 16.89,7.04 C25.2
N$10
  Top 0.254: U2.16 10,39.25 9,40.25 7.5,40.25 7.25,40.5 7.25,41.5 7,41.75 L21.2
N$11
  Top 0.254: U2.7 15.25,50.5 15.5,50.75 17,50.75 | 17,50.75 17.25,51 26,51 26.12,50.88 26.25,50.75 RESET.4 | 17,50.75 RESET.3
N$12  (via drill 0.4)
  Top 0.254: U5.24 43.84,55.59 v44.25,56
  Bottom 0.254: C38.1 v44.25,56
N$13
  Top 0.46: U3.11 16.18,24.82 L17.1
N$14
  Top 0.46: L17.2 C26.1 17.05,18.9
  Top 0.5: 17.05,18.9 L18.1
N$15
  Top 0.254: 17.1,15.55 C24.1
  Top 0.46: L18.2 C24.1
N$16
  Top 0.254: 17.15,9.05 17,8.9 C25.1
  Top 0.46: C24.2 17.1,12.55 | C27.1 L20.1 17.15,9.05
  Top 0.5: 17.1,12.55 C27.1
N$17  (via drill 0.4)
  Top 0.254: U2.26 U2.27 U2.28
  Top 0.3: U2.28 17.25,35.75 C10.1 18.15,34.85 L7.1
  Bottom 0.3: 17.85,35.25 C10.1 17.75,34.75 C9.1
  other vias: 17.75,35.25
N$18
  Top 0.254: U2.36 20.25,39.75 20.75,39.25 21.75,39.25 22,39 22,38.5 22.06,38.5 L22.1
N$19
  Top 0.254: U2.30 18.5,36.5 19,35.75 20,35.75 20.75,34.75 20.85,34.85 R4.2
N$20  (via drill 0.4)
  Top 0.254: U5.18 44.91,52.09 v45,52
  Bottom 0.254: 43.64,52.5 C40.1 44.6,52.4 v45,52
N$21  (via drill 0.4)
  Top 0.254: v20,42 20,41.5 19.75,41.25 U2.39
  Bottom 0.254: C22.1 19.5,41 20,41.5 v20,42
N$22  (via drill 0.4)
  Top 0.254: U2.23 14.75,35 14.1,34.35 L8.1 | L8.1 13.85,34.6 v13.75,34.4 C11.1 13.7,34.4 L8.1
  Bottom 0.254: C11.1 13.55,34.45 v13.75,34.4
N$23
  Top 0.254: U2.13 10.75,40.75 9.75,41.75 9,41.75 8.75,42 8.75,47 8,47.75 L15.2
N$24
  Top 0.254: U2.19 R6.1
N$25
  Top 0.254: U2.15 10.25,39.75 9.25,40.75 8,40.75 7.75,41 7.75,43.25 7.25,43.75 L19.2
N$26  (via drill 0.4)
  Top 0.254: L9.1 v11.45,36.8 12.3,36.8 12.75,37.25 U2.20
  Bottom 0.254: 11.55,36.85 C12.1 v11.45,36.8
N$27
  Top 0.254: U2.17 9.75,38.75 8.75,39.75 L23.2 6.25,39.75
N$28
  Top 0.254: U2.9 14.25,44.5 13.5,45.25 13.5,47 13.75,47.25 R5.1
N$29
  Top 0.254: GIO1.A 14.15,49 R5.2
N$30  (via drill 0.4)
  Top 0.254: U2.31 19,37 19.5,36.5 v20,36.5 L6.1
  Bottom 0.254: C8.1 v20,36.5
N$31
  Top 0.254: PWR.A 9.5,71.1 9.5,69.75 R3.1
N$32  (via drill 0.4)
  Top 0.254: U5.29 41.11,57.39 v41,57.5
  Bottom 0.254: C39.1 40.77,57.27 v41,57.5
N$33  (via drill 0.4)
  Top 0.254: C34.1 46,45.25 v47.25,46.5
  Bottom 0.254: v47.25,46.5 47.25,74 45.5,75.75 40.46,75.75 IN.2
N$34
  Top 0.254: U5.14 42.11,50.14 43,49.25 43,47.5 43.25,47.25 C33.2 44.25,47.25
N$35
  Top 0.254: U5.13 41.61,49.89 42.5,49 42.5,45.75 43,45.25 C34.2
N$36
  Top 0.2: 46.75,48.25 46.75,57.75
  Top 0.254: C33.1 45.85,47.35 46.75,48.25 | 46.75,57.75 47.25,58.25 47.25,68.5 45.5,70.25 40.48,70.25 IN.4
N$37
  Top 0.254: OUT.2 34.25,6.24 34.25,10.5 35.25,11.5 37.5,11.5 38.25,10.75 46.5,10.75 48,12.25 48,53.6 47.7,53.9 47.66,53.9 C31.2
N$38
  Top 0.254: OUT.4 46.46,9.76 48.5,11.8 48.5,55.7 48.3,55.9 47.6,55.9 C32.2
N$39
  Top 0.254: U5.22 45.71,54.09 C31.1
N$40
  Top 0.254: U5.23 44.4,54.59 C32.1
N$41  (via drill 0.4)
  Top 0.254: U2.10 13.75,43.75 v13.25,44.25 12.75,44.75 12.75,46.5 L5.1
  Bottom 0.254: v13.25,44.25 13.25,44.15 C7.1
N$42  (via drill 0.4)
  Top 0.254: U2.12 11.75,41.25 v11.5,41.5 11.5,42.65 L4.1
  Bottom 0.254: C6.1 v11.5,41.5
N$43  (via drill 0.4)
  Top 0.254: U2.18 8.35,38.25 L3.1 v8.25,38.65 8.25,38.5
  Bottom 0.254: v8.25,38.65 8.25,38.5 8.35,38.6 | 8.5,38.5 8.38,38.62 8.35,38.6 | 8.25,38.35 8.3,38.4 C5.1 8.35,38.6
N$44  (via drill 0.4)
  Top 0.254: U2.37 v20.75,40.25 21.65,40.25 L2.1
  Bottom 0.254: C4.1 20.5,39.25 20.75,39.5 v20.75,40.25
N$45  (via drill 0.4)
  Top 0.254: U2.40 v19,43.25 19,44.25 19.5,44.75 20.25,44.75 L1.1
  Bottom 0.254: C3.1 19.25,43.5 v19,43.25
N$46
  Top 0.254: U4.13 36.92,36.92 36.5,36.5 36.5,33.25 34.25,31 34.25,29.75 32.75,28.25 R11.2
N$47
  Top 0.254: AVR_GIO.A R11.1
N$48
  Top 0.254: U4.2 45.08,36.92 45.5,36.5 45.5,32.75 44,31.25 44,30.5 43.4,29.9 X2.1 42.68,29.93 42.75,30 42.05,30.7 C41.2
N$49
  Top 0.254: U4.3 45.56,38.19 46.75,37 46.75,24.5 45.75,23.5 45.25,23.5 45.22,23.53 X2.3 45.1,23.48 C42.2
PA_EN  (via drill 0.4)
  Top 0.254: 13.85,29 v12.9,30
  Top 0.3: 13,30 v12.9,30 R9.2 | U3.5 13.85,29 | 23.8,38.6 v23.85,38.6 23.82,38.53 L22.2
  Bottom 0.254: v23.85,38.6 23.1,38.6 22.75,38.25 22.75,32.5 21,30.75 13.25,30.75 12.9,30.4 v12.9,30
RESET_AVR  (via drill 0.4)
  Top 0.254: v46,39.5 43.66,39.5 U4.4
  Bottom 0.254: ISP.5 41.98,35.48 v46,39.5
RESET_CC8531  (via drill 0.4)
  Top 0.254: U5.31 40.11,56.64 39,57.75 34,57.75 32.5,56.25 v32.5,56 | v41.25,42 U4.6 | L14.2 9.79,44.71 9.75,45 9.75,50 11.5,51.75 32,51.75 v32.5,51.25 33,51.25 33.75,50.5 35.25,50.5 36,49.75 v36,47.25 35.43,46.68 J2.7
  Bottom 0.254: v32.5,56 v32.5,51.25 | v36,47.25 36,42.5 36.75,41.75 41,41.75 v41.25,42
RF_N
  Top 0.254: 16.2,29.95 U3.2
  Top 0.3: U2.25 15.75,31.95 16.2,31.5 16.2,29.95
RF_P
  Top 0.3: U3.4 14.88,31.64 15.25,32 U2.24
SCLK  (via drill 0.4)
  Top 0.254: U2.4 16.75,48.5 17,48.75 25,48.75 v25.5,48.25 25.5,45.75 25.84,45.41 J2.6 29.91,45.41 v30,45.5 | U5.8 38.88,48.13 v38.75,48 38.75,46 39.5,45.25 39.5,42.75 38.75,42 U4.9 36.25,42 v35.5,41.25 | ISP.3 34.69,32.94 35.5,33.75 v35.5,37.5 | SD1.5 27.18,57.07 v28.75,55.5
  Bottom 0.254: v38.75,48 32.25,48 32,47.75 32,46 31.5,45.5 v30,45.5 | v35.5,37.5 v35.5,41.25 | v28.75,55.5 28.75,50.5 v25.5,48.25
WCLK  (via drill 0.4)
  Top 0.254: L19.1 4,43.75 3,44.75 3,48.75 4.25,50 7.5,50 10.75,53.25 v34,53.25 | U5.3 36.41,54.09 v36,54.5
  Bottom 0.254: v34,53.25 34.75,53.25 v36,54.5

### Text on the board
tDocu: AVDD_PA1 | 1.85mm | 6.90mm | AVDD_LNA | AVDD_PA2 | 2.40mm